# Altium schematic sheet MKicroBUS.schdoc: TITRE
size Letter; ApprovedBy: APPROUVÉ PAR; Organization: Cegep Limoilou; Address1: 1300, 8e Avenue; Address2: Québec, QC; Address3: Canada; Address4: G1J 5L5; SheetNumber: 6; SheetTotal: 6
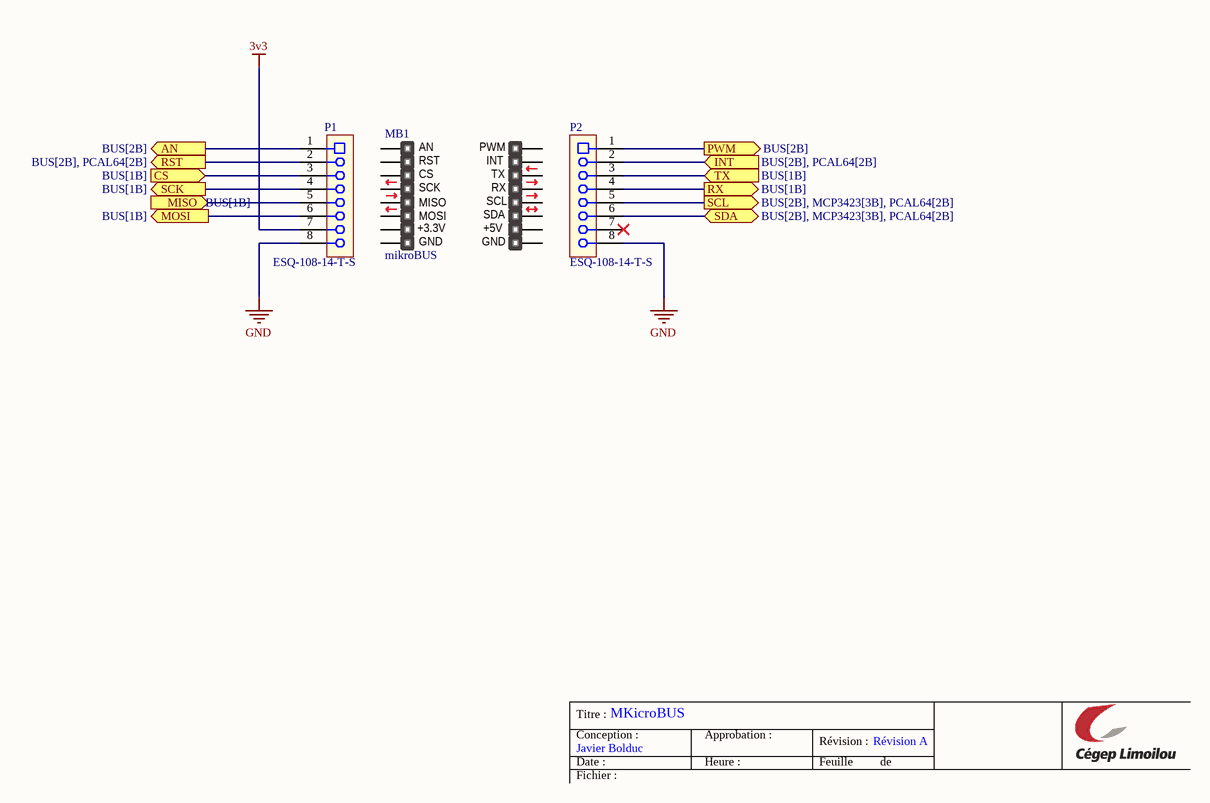
[diagram p0: MKicroBUS.schdoc]

## Parts
MB1  mikroBUS  [mikroBUS-Midi-No-Connector]  (no BOM)
P1  ESQ-108-14-T-S  [CONN_SKT_01X08_100MIL-ELEVATED-LONGPIN]
P2  ESQ-108-14-T-S  [CONN_SKT_01X08_100MIL-ELEVATED-LONGPIN]

## Ports
AN (out, see BUS[2B]), CS (in, see BUS[1B]), INT (in, see BUS[2B], PCAL64[2B]), MISO (in, see BUS[1B]), MOSI (out, see BUS[1B]), PWM (out, see BUS[2B]), RST (out, see BUS[2B], PCAL64[2B]), RX (out, see BUS[1B]), SCK (out, see BUS[1B]), SCL (out, see BUS[2B], MCP3423[3B], PCAL64[2B]), SDA (bidir, see BUS[2B], MCP3423[3B], PCAL64[2B]), TX (in, see BUS[1B])

## Nets
3v3: P1.7
GND: P1.8 P2.8
AN: P1.1 ; port AN
CS: P1.3 ; port CS
INT: P2.2 ; port INT
MISO: P1.5 ; port MISO
MOSI: P1.6 ; port MOSI
PWM: P2.1 ; port PWM
RST: P1.2 ; port RST
RX: P2.4 ; port RX
SCK: P1.4 ; port SCK
SCL: P2.5 ; port SCL
SDA: P2.6 ; port SDA
TX: P2.3 ; port TX

Not connected (* = marked no-connect by the designer): MB1 1(AN) 2(RST) 3(CS) 4(SCK) 5(MISO) 6(MOSI) 7(3.3V) 8(GND) 9(GND) 10(5V) 11(SDA) 12(SCL) 13(TX) 14(RX) 15(INT) 16(PWM); P2 7*

## Notes on the sheet
- Titre :
- Conception :
- Date :
- Javier Bolduc
- MKicroBUS
- Approbation :
- Heure :
- Révision :
- Feuille
- Révision A
- de
- Fichier :
- (in symbol mikroBUS compatible add-on board) +3.3V; +5V

## Library data of the parts
MB1 = mikroBUS compatible add-on board
P1 P2 = CONN-100MIL-SKT-01X08_ELEVATED_LONGPIN: CONN SOCKET 8pos 100mils Elevated; Manufacturer 1: Samtec; Mounting Technology: TH; Manufacturer Part Number 1: ESQ-108-14-T-S; Supplier 1: Digikey; Supplier Part Number 1: SAM9303-ND